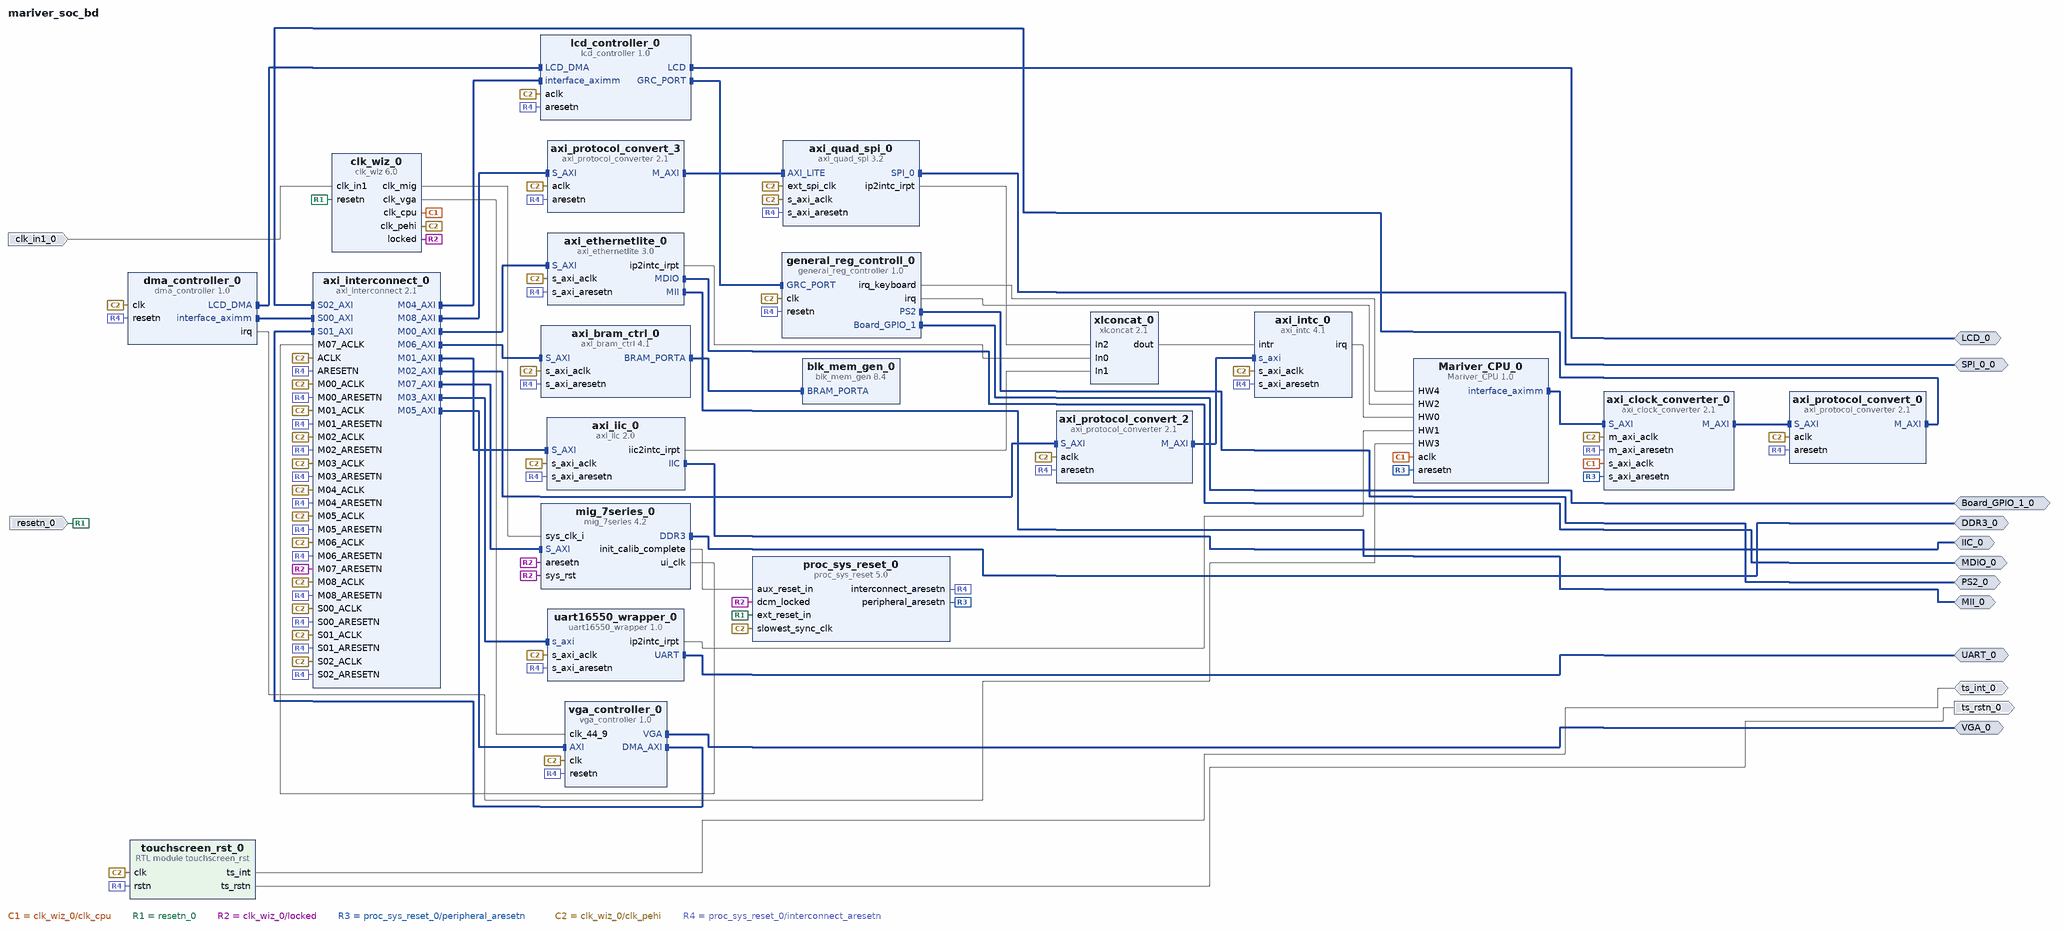
[diagram p0: block diagram of the top level]
# Vivado block design mariver_soc_bd, xc7a200tfbg676-2, Vivado 2019.2
create_bd_design mariver_soc_bd

create_bd_intf_port -mode Master -vlnv xilinx.com:interface:mii_rtl:1.0 MII_0
create_bd_intf_port -mode Master -vlnv xilinx.com:interface:mdio_rtl:1.0 MDIO_0
create_bd_intf_port -mode Master -vlnv xilinx.com:interface:iic_rtl:1.0 IIC_0
create_bd_intf_port -mode Master -vlnv jielahou:HIT_Mariver:UART_rtl:1.0 UART_0
create_bd_intf_port -mode Master -vlnv ywy_c_asm:HIT_Mariver:LCD_rtl:1.0 LCD_0
create_bd_intf_port -mode Master -vlnv ywy_c_asm:HIT_Mariver:PS2_rtl:1.0 PS2_0
create_bd_intf_port -mode Master -vlnv ywy_c_asm:HIT_Mariver:Board_GPIO_rtl:1.0 Board_GPIO_1_0
create_bd_intf_port -mode Master -vlnv ywy_c_asm:HIT_Mariver:VGA_rtl:1.0 VGA_0
create_bd_intf_port -mode Master -vlnv xilinx.com:interface:ddrx_rtl:1.0 DDR3_0
create_bd_intf_port -mode Master -vlnv xilinx.com:interface:spi_rtl:1.0 SPI_0_0
create_bd_port -dir I -type clk clk_in1_0
create_bd_port -dir I -type rst resetn_0
create_bd_port -dir IO ts_int_0
create_bd_port -dir O -type rst ts_rstn_0

create_bd_cell -type ip -vlnv ywy_c_asm:HIT_Mariver:Mariver_CPU:1.0 Mariver_CPU_0
create_bd_cell -type ip -vlnv xilinx.com:ip:clk_wiz:6.0 clk_wiz_0
set_property -dict [list \
  CONFIG.CLKOUT1_DRIVES BUFG \
  CONFIG.CLKOUT1_JITTER 81.234 \
  CONFIG.CLKOUT1_PHASE_ERROR 84.134 \
  CONFIG.CLKOUT2_DRIVES BUFG \
  CONFIG.CLKOUT2_JITTER 72.111 \
  CONFIG.CLKOUT2_PHASE_ERROR 84.134 \
  CONFIG.CLKOUT2_REQUESTED_OUT_FREQ 200.000 \
  CONFIG.CLKOUT2_USED true \
  CONFIG.CLKOUT3_DRIVES BUFG \
  CONFIG.CLKOUT3_JITTER 81.234 \
  CONFIG.CLKOUT3_PHASE_ERROR 84.134 \
  CONFIG.CLKOUT3_USED true \
  CONFIG.CLKOUT4_DRIVES BUFG \
  CONFIG.CLKOUT4_JITTER 87.707 \
  CONFIG.CLKOUT4_PHASE_ERROR 84.134 \
  CONFIG.CLKOUT4_REQUESTED_OUT_FREQ 65.000 \
  CONFIG.CLKOUT4_USED true \
  CONFIG.CLKOUT5_DRIVES BUFG \
  CONFIG.CLKOUT6_DRIVES BUFG \
  CONFIG.CLKOUT7_DRIVES BUFG \
  CONFIG.CLK_OUT1_PORT clk_cpu \
  CONFIG.CLK_OUT2_PORT clk_mig \
  CONFIG.CLK_OUT3_PORT clk_pehi \
  CONFIG.CLK_OUT4_PORT clk_vga \
  CONFIG.MMCM_BANDWIDTH OPTIMIZED \
  CONFIG.MMCM_CLKFBOUT_MULT_F 18 \
  CONFIG.MMCM_CLKOUT0_DIVIDE_F 18 \
  CONFIG.MMCM_CLKOUT1_DIVIDE 9 \
  CONFIG.MMCM_CLKOUT2_DIVIDE 18 \
  CONFIG.MMCM_CLKOUT3_DIVIDE 28 \
  CONFIG.MMCM_COMPENSATION ZHOLD \
  CONFIG.NUM_OUT_CLKS 4 \
  CONFIG.PRIMITIVE PLL \
  CONFIG.RESET_PORT resetn \
  CONFIG.RESET_TYPE ACTIVE_LOW \
] [get_bd_cells clk_wiz_0]
create_bd_cell -type ip -vlnv xilinx.com:ip:proc_sys_reset:5.0 proc_sys_reset_0
create_bd_cell -type ip -vlnv xilinx.com:ip:axi_clock_converter:2.1 axi_clock_converter_0
create_bd_cell -type ip -vlnv xilinx.com:ip:axi_protocol_converter:2.1 axi_protocol_convert_0
create_bd_cell -type ip -vlnv xilinx.com:ip:axi_interconnect:2.1 axi_interconnect_0
set_property -dict {CONFIG.NUM_MI 9 CONFIG.NUM_SI 3} [get_bd_cells axi_interconnect_0]
create_bd_cell -type module -reference touchscreen_rst touchscreen_rst_0
create_bd_cell -type ip -vlnv xilinx.com:ip:axi_iic:2.0 axi_iic_0
set_property -dict {CONFIG.IIC_FREQ_KHZ 250} [get_bd_cells axi_iic_0]
create_bd_cell -type ip -vlnv xilinx.com:ip:axi_intc:4.1 axi_intc_0
set_property -dict {CONFIG.C_IRQ_CONNECTION 1} [get_bd_cells axi_intc_0]
create_bd_cell -type ip -vlnv xilinx.com:ip:axi_ethernetlite:3.0 axi_ethernetlite_0
set_property -dict {CONFIG.C_S_AXI_PROTOCOL AXI4} [get_bd_cells axi_ethernetlite_0]
create_bd_cell -type ip -vlnv xilinx.com:ip:xlconcat:2.1 xlconcat_0
set_property -dict {CONFIG.NUM_PORTS 3} [get_bd_cells xlconcat_0]
create_bd_cell -type ip -vlnv Xilinx:user:uart16550_wrapper:1.0 uart16550_wrapper_0
create_bd_cell -type ip -vlnv user.org:user:general_reg_controller:1.0 general_reg_controll_0
create_bd_cell -type ip -vlnv ywy_c_asm:HIT_Mariver:lcd_controller:1.0 lcd_controller_0
create_bd_cell -type ip -vlnv user.org:user:dma_controller:1.0 dma_controller_0
create_bd_cell -type ip -vlnv ywy_c_asm:HIT_Mariver:vga_controller:1.0 vga_controller_0
create_bd_cell -type ip -vlnv xilinx.com:ip:axi_bram_ctrl:4.1 axi_bram_ctrl_0
set_property -dict {CONFIG.SINGLE_PORT_BRAM 1} [get_bd_cells axi_bram_ctrl_0]
create_bd_cell -type ip -vlnv xilinx.com:ip:blk_mem_gen:8.4 blk_mem_gen_0
set_property -dict [list \
  CONFIG.Coe_File ../../../../../../../src/bootloader/u-boot.coe \
  CONFIG.EN_SAFETY_CKT false \
  CONFIG.Load_Init_File true \
  CONFIG.Memory_Type Single_Port_ROM \
  CONFIG.Port_A_Write_Rate 0 \
] [get_bd_cells blk_mem_gen_0]
create_bd_cell -type ip -vlnv xilinx.com:ip:mig_7series:4.2 mig_7series_0
set_property -dict [list \
  CONFIG.BOARD_MIG_PARAM Custom \
  CONFIG.RESET_BOARD_INTERFACE Custom \
  CONFIG.XML_INPUT_FILE mig_a.prj \
] [get_bd_cells mig_7series_0]
create_bd_cell -type ip -vlnv xilinx.com:ip:axi_protocol_converter:2.1 axi_protocol_convert_2
create_bd_cell -type ip -vlnv xilinx.com:ip:axi_quad_spi:3.2 axi_quad_spi_0
set_property -dict {CONFIG.C_USE_STARTUP 0 CONFIG.Multiples16 4} [get_bd_cells axi_quad_spi_0]
create_bd_cell -type ip -vlnv xilinx.com:ip:axi_protocol_converter:2.1 axi_protocol_convert_3

# ---- connections ----

connect_bd_intf_net [get_bd_intf_pins axi_protocol_convert_2/M_AXI] [get_bd_intf_pins axi_intc_0/s_axi]
connect_bd_intf_net [get_bd_intf_ports SPI_0_0] [get_bd_intf_pins axi_quad_spi_0/SPI_0]
connect_bd_intf_net [get_bd_intf_ports LCD_0] [get_bd_intf_pins lcd_controller_0/LCD]
connect_bd_intf_net [get_bd_intf_pins vga_controller_0/DMA_AXI] [get_bd_intf_pins axi_interconnect_0/S01_AXI]
connect_bd_intf_net [get_bd_intf_pins lcd_controller_0/GRC_PORT] [get_bd_intf_pins general_reg_controll_0/GRC_PORT]
connect_bd_intf_net [get_bd_intf_pins Mariver_CPU_0/interface_aximm] [get_bd_intf_pins axi_clock_converter_0/S_AXI]
connect_bd_intf_net [get_bd_intf_pins dma_controller_0/LCD_DMA] [get_bd_intf_pins lcd_controller_0/LCD_DMA]
connect_bd_intf_net [get_bd_intf_pins axi_interconnect_0/M00_AXI] [get_bd_intf_pins axi_ethernetlite_0/S_AXI]
connect_bd_intf_net [get_bd_intf_pins axi_protocol_convert_3/M_AXI] [get_bd_intf_pins axi_quad_spi_0/AXI_LITE]
connect_bd_intf_net [get_bd_intf_pins axi_clock_converter_0/M_AXI] [get_bd_intf_pins axi_protocol_convert_0/S_AXI]
connect_bd_intf_net [get_bd_intf_pins axi_interconnect_0/M01_AXI] [get_bd_intf_pins axi_iic_0/S_AXI]
connect_bd_intf_net [get_bd_intf_pins axi_protocol_convert_0/M_AXI] [get_bd_intf_pins axi_interconnect_0/S02_AXI]
connect_bd_intf_net [get_bd_intf_ports PS2_0] [get_bd_intf_pins general_reg_controll_0/PS2]
connect_bd_intf_net [get_bd_intf_pins dma_controller_0/interface_aximm] [get_bd_intf_pins axi_interconnect_0/S00_AXI]
connect_bd_intf_net [get_bd_intf_ports UART_0] [get_bd_intf_pins uart16550_wrapper_0/UART]
connect_bd_intf_net [get_bd_intf_pins axi_protocol_convert_2/S_AXI] [get_bd_intf_pins axi_interconnect_0/M02_AXI]
connect_bd_intf_net [get_bd_intf_pins lcd_controller_0/interface_aximm] [get_bd_intf_pins axi_interconnect_0/M04_AXI]
connect_bd_intf_net [get_bd_intf_pins uart16550_wrapper_0/s_axi] [get_bd_intf_pins axi_interconnect_0/M03_AXI]
connect_bd_intf_net [get_bd_intf_pins axi_interconnect_0/M05_AXI] [get_bd_intf_pins vga_controller_0/AXI]
connect_bd_intf_net [get_bd_intf_ports Board_GPIO_1_0] [get_bd_intf_pins general_reg_controll_0/Board_GPIO_1]
connect_bd_intf_net [get_bd_intf_pins axi_bram_ctrl_0/BRAM_PORTA] [get_bd_intf_pins blk_mem_gen_0/BRAM_PORTA]
connect_bd_intf_net [get_bd_intf_ports MDIO_0] [get_bd_intf_pins axi_ethernetlite_0/MDIO]
connect_bd_intf_net [get_bd_intf_ports MII_0] [get_bd_intf_pins axi_ethernetlite_0/MII]
connect_bd_intf_net [get_bd_intf_ports VGA_0] [get_bd_intf_pins vga_controller_0/VGA]
connect_bd_intf_net [get_bd_intf_ports IIC_0] [get_bd_intf_pins axi_iic_0/IIC]
connect_bd_intf_net [get_bd_intf_ports DDR3_0] [get_bd_intf_pins mig_7series_0/DDR3]
connect_bd_intf_net [get_bd_intf_pins axi_interconnect_0/M08_AXI] [get_bd_intf_pins axi_protocol_convert_3/S_AXI]
connect_bd_intf_net [get_bd_intf_pins axi_interconnect_0/M07_AXI] [get_bd_intf_pins mig_7series_0/S_AXI]
connect_bd_intf_net [get_bd_intf_pins axi_interconnect_0/M06_AXI] [get_bd_intf_pins axi_bram_ctrl_0/S_AXI]
connect_bd_net [get_bd_pins clk_wiz_0/clk_cpu] [get_bd_pins Mariver_CPU_0/aclk] [get_bd_pins axi_clock_converter_0/s_axi_aclk]
connect_bd_net -net clk_in1_0_1 [get_bd_ports clk_in1_0] [get_bd_pins clk_wiz_0/clk_in1]
connect_bd_net -net resetn_0_1 [get_bd_ports resetn_0] [get_bd_pins clk_wiz_0/resetn] [get_bd_pins proc_sys_reset_0/ext_reset_in]
connect_bd_net [get_bd_pins clk_wiz_0/locked] \
  [get_bd_pins proc_sys_reset_0/dcm_locked] [get_bd_pins mig_7series_0/sys_rst] [get_bd_pins mig_7series_0/aresetn] \
  [get_bd_pins axi_interconnect_0/M07_ARESETN]
connect_bd_net [get_bd_pins proc_sys_reset_0/peripheral_aresetn] [get_bd_pins Mariver_CPU_0/aresetn] [get_bd_pins axi_clock_converter_0/s_axi_aresetn]
connect_bd_net [get_bd_pins clk_wiz_0/clk_pehi] \
  [get_bd_pins axi_clock_converter_0/m_axi_aclk] [get_bd_pins axi_protocol_convert_0/aclk] \
  [get_bd_pins axi_interconnect_0/ACLK] [get_bd_pins axi_interconnect_0/S02_ACLK] [get_bd_pins touchscreen_rst_0/clk] \
  [get_bd_pins axi_iic_0/s_axi_aclk] [get_bd_pins axi_ethernetlite_0/s_axi_aclk] [get_bd_pins axi_interconnect_0/M00_ACLK] \
  [get_bd_pins axi_interconnect_0/M01_ACLK] [get_bd_pins axi_intc_0/s_axi_aclk] [get_bd_pins uart16550_wrapper_0/s_axi_aclk] \
  [get_bd_pins axi_interconnect_0/M03_ACLK] [get_bd_pins axi_interconnect_0/M04_ACLK] [get_bd_pins dma_controller_0/clk] \
  [get_bd_pins lcd_controller_0/aclk] [get_bd_pins general_reg_controll_0/clk] [get_bd_pins vga_controller_0/clk] \
  [get_bd_pins axi_bram_ctrl_0/s_axi_aclk] [get_bd_pins axi_interconnect_0/M06_ACLK] \
  [get_bd_pins axi_interconnect_0/M05_ACLK] [get_bd_pins axi_interconnect_0/S00_ACLK] \
  [get_bd_pins axi_interconnect_0/S01_ACLK] [get_bd_pins axi_protocol_convert_2/aclk] \
  [get_bd_pins proc_sys_reset_0/slowest_sync_clk] [get_bd_pins axi_protocol_convert_3/aclk] \
  [get_bd_pins axi_quad_spi_0/ext_spi_clk] [get_bd_pins axi_quad_spi_0/s_axi_aclk] [get_bd_pins axi_interconnect_0/M02_ACLK] \
  [get_bd_pins axi_interconnect_0/M08_ACLK]
connect_bd_net [get_bd_pins xlconcat_0/dout] [get_bd_pins axi_intc_0/intr]
connect_bd_net [get_bd_pins axi_ethernetlite_0/ip2intc_irpt] [get_bd_pins xlconcat_0/In0]
connect_bd_net [get_bd_pins axi_iic_0/iic2intc_irpt] [get_bd_pins xlconcat_0/In1]
connect_bd_net [get_bd_pins axi_intc_0/irq] [get_bd_pins Mariver_CPU_0/HW0]
connect_bd_net [get_bd_pins uart16550_wrapper_0/ip2intc_irpt] [get_bd_pins Mariver_CPU_0/HW1]
connect_bd_net [get_bd_pins dma_controller_0/irq] [get_bd_pins Mariver_CPU_0/HW3]
connect_bd_net [get_bd_pins general_reg_controll_0/irq_keyboard] [get_bd_pins Mariver_CPU_0/HW4]
connect_bd_net [get_bd_pins general_reg_controll_0/irq] [get_bd_pins Mariver_CPU_0/HW2]
connect_bd_net [get_bd_pins clk_wiz_0/clk_vga] [get_bd_pins vga_controller_0/clk_44_9]
connect_bd_net [get_bd_pins clk_wiz_0/clk_mig] [get_bd_pins mig_7series_0/sys_clk_i]
connect_bd_net [get_bd_pins mig_7series_0/ui_clk] [get_bd_pins axi_interconnect_0/M07_ACLK]
connect_bd_net [get_bd_pins mig_7series_0/init_calib_complete] [get_bd_pins proc_sys_reset_0/aux_reset_in]
connect_bd_net [get_bd_ports ts_int_0] [get_bd_pins touchscreen_rst_0/ts_int]
connect_bd_net [get_bd_pins touchscreen_rst_0/ts_rstn] [get_bd_ports ts_rstn_0]
connect_bd_net [get_bd_pins proc_sys_reset_0/interconnect_aresetn] \
  [get_bd_pins axi_clock_converter_0/m_axi_aresetn] [get_bd_pins axi_protocol_convert_0/aresetn] \
  [get_bd_pins axi_interconnect_0/ARESETN] [get_bd_pins axi_interconnect_0/S02_ARESETN] [get_bd_pins touchscreen_rst_0/rstn] \
  [get_bd_pins axi_iic_0/s_axi_aresetn] [get_bd_pins axi_ethernetlite_0/s_axi_aresetn] \
  [get_bd_pins axi_interconnect_0/M00_ARESETN] [get_bd_pins axi_interconnect_0/M01_ARESETN] \
  [get_bd_pins axi_intc_0/s_axi_aresetn] [get_bd_pins uart16550_wrapper_0/s_axi_aresetn] \
  [get_bd_pins axi_interconnect_0/M03_ARESETN] [get_bd_pins axi_interconnect_0/M04_ARESETN] \
  [get_bd_pins dma_controller_0/resetn] [get_bd_pins lcd_controller_0/aresetn] [get_bd_pins general_reg_controll_0/resetn] \
  [get_bd_pins vga_controller_0/resetn] [get_bd_pins axi_bram_ctrl_0/s_axi_aresetn] \
  [get_bd_pins axi_interconnect_0/M06_ARESETN] [get_bd_pins axi_interconnect_0/M05_ARESETN] \
  [get_bd_pins axi_interconnect_0/S00_ARESETN] [get_bd_pins axi_interconnect_0/S01_ARESETN] \
  [get_bd_pins axi_protocol_convert_2/aresetn] [get_bd_pins axi_protocol_convert_3/aresetn] \
  [get_bd_pins axi_quad_spi_0/s_axi_aresetn] [get_bd_pins axi_interconnect_0/M02_ARESETN] \
  [get_bd_pins axi_interconnect_0/M08_ARESETN]
connect_bd_net [get_bd_pins axi_quad_spi_0/ip2intc_irpt] [get_bd_pins xlconcat_0/In2]

# ---- address map ----
assign_bd_address -offset 0x00000000 -range 128M -target_address_space [get_bd_addr_spaces dma_controller_0/interface_aximm] [get_bd_addr_segs mig_7series_0/memmap/memaddr]
assign_bd_address -offset 0x1FA00000 -range 64K -target_address_space [get_bd_addr_spaces dma_controller_0/interface_aximm] [get_bd_addr_segs axi_iic_0/S_AXI/Reg]
assign_bd_address -offset 0x1FB00000 -range 64K -target_address_space [get_bd_addr_spaces dma_controller_0/interface_aximm] [get_bd_addr_segs axi_intc_0/S_AXI/Reg]
assign_bd_address -offset 0x1FC00000 -range 256K -target_address_space [get_bd_addr_spaces dma_controller_0/interface_aximm] [get_bd_addr_segs axi_bram_ctrl_0/S_AXI/Mem0]
assign_bd_address -offset 0x1FD00000 -range 64K -target_address_space [get_bd_addr_spaces dma_controller_0/interface_aximm] [get_bd_addr_segs lcd_controller_0/interface_aximm/reg0]
assign_bd_address -offset 0x1FE00000 -range 64K -target_address_space [get_bd_addr_spaces dma_controller_0/interface_aximm] [get_bd_addr_segs vga_controller_0/s/reg0]
assign_bd_address -offset 0x1FE40000 -range 64K -target_address_space [get_bd_addr_spaces dma_controller_0/interface_aximm] [get_bd_addr_segs uart16550_wrapper_0/s_axi/reg0]
assign_bd_address -offset 0x1FE80000 -range 64K -target_address_space [get_bd_addr_spaces dma_controller_0/interface_aximm] [get_bd_addr_segs axi_quad_spi_0/AXI_LITE/Reg]
assign_bd_address -offset 0x1FF00000 -range 1M -target_address_space [get_bd_addr_spaces dma_controller_0/interface_aximm] [get_bd_addr_segs axi_ethernetlite_0/S_AXI/Reg]
assign_bd_address -offset 0x00000000 -range 128M -target_address_space [get_bd_addr_spaces Mariver_CPU_0/interface_aximm] [get_bd_addr_segs mig_7series_0/memmap/memaddr]
assign_bd_address -offset 0x1FA00000 -range 64K -target_address_space [get_bd_addr_spaces Mariver_CPU_0/interface_aximm] [get_bd_addr_segs axi_iic_0/S_AXI/Reg]
assign_bd_address -offset 0x1FB00000 -range 64K -target_address_space [get_bd_addr_spaces Mariver_CPU_0/interface_aximm] [get_bd_addr_segs axi_intc_0/S_AXI/Reg]
assign_bd_address -offset 0x1FC00000 -range 256K -target_address_space [get_bd_addr_spaces Mariver_CPU_0/interface_aximm] [get_bd_addr_segs axi_bram_ctrl_0/S_AXI/Mem0]
assign_bd_address -offset 0x1FD00000 -range 64K -target_address_space [get_bd_addr_spaces Mariver_CPU_0/interface_aximm] [get_bd_addr_segs lcd_controller_0/interface_aximm/reg0]
assign_bd_address -offset 0x1FE00000 -range 64K -target_address_space [get_bd_addr_spaces Mariver_CPU_0/interface_aximm] [get_bd_addr_segs vga_controller_0/s/reg0]
assign_bd_address -offset 0x1FE40000 -range 64K -target_address_space [get_bd_addr_spaces Mariver_CPU_0/interface_aximm] [get_bd_addr_segs uart16550_wrapper_0/s_axi/reg0]
assign_bd_address -offset 0x1FE80000 -range 64K -target_address_space [get_bd_addr_spaces Mariver_CPU_0/interface_aximm] [get_bd_addr_segs axi_quad_spi_0/AXI_LITE/Reg]
assign_bd_address -offset 0x1FF00000 -range 1M -target_address_space [get_bd_addr_spaces Mariver_CPU_0/interface_aximm] [get_bd_addr_segs axi_ethernetlite_0/S_AXI/Reg]
assign_bd_address -offset 0x00000000 -range 128M -target_address_space [get_bd_addr_spaces vga_controller_0/dma] [get_bd_addr_segs mig_7series_0/memmap/memaddr]
assign_bd_address -offset 0x1FA00000 -range 64K -target_address_space [get_bd_addr_spaces vga_controller_0/dma] [get_bd_addr_segs axi_iic_0/S_AXI/Reg]
assign_bd_address -offset 0x1FB00000 -range 64K -target_address_space [get_bd_addr_spaces vga_controller_0/dma] [get_bd_addr_segs axi_intc_0/S_AXI/Reg]
assign_bd_address -offset 0x1FC00000 -range 256K -target_address_space [get_bd_addr_spaces vga_controller_0/dma] [get_bd_addr_segs axi_bram_ctrl_0/S_AXI/Mem0]
assign_bd_address -offset 0x1FD00000 -range 64K -target_address_space [get_bd_addr_spaces vga_controller_0/dma] [get_bd_addr_segs lcd_controller_0/interface_aximm/reg0]
assign_bd_address -offset 0x1FE00000 -range 64K -target_address_space [get_bd_addr_spaces vga_controller_0/dma] [get_bd_addr_segs vga_controller_0/s/reg0]
assign_bd_address -offset 0x1FE40000 -range 64K -target_address_space [get_bd_addr_spaces vga_controller_0/dma] [get_bd_addr_segs uart16550_wrapper_0/s_axi/reg0]
assign_bd_address -offset 0x1FE80000 -range 64K -target_address_space [get_bd_addr_spaces vga_controller_0/dma] [get_bd_addr_segs axi_quad_spi_0/AXI_LITE/Reg]
assign_bd_address -offset 0x1FF00000 -range 1M -target_address_space [get_bd_addr_spaces vga_controller_0/dma] [get_bd_addr_segs axi_ethernetlite_0/S_AXI/Reg]

validate_bd_design
save_bd_design
